# EAGLE schematic LayerOne_2016 (EAGLE 7.5.0)

## Sheet 1 of 3
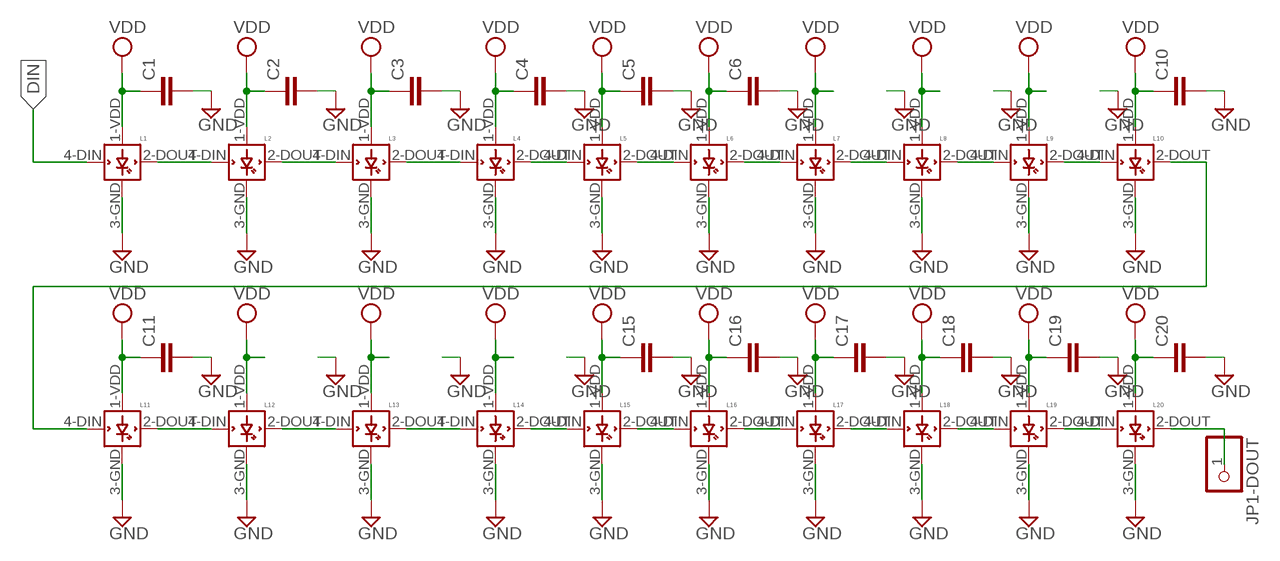
[diagram p0: schematic, sheet 1]

### Parts
C1  CAP0805  [0805]
C2  CAP0805  [0805]
C3  CAP0805  [0805]
C4  CAP0805  [0805]
C5  CAP0805  [0805]
C6  CAP0805  [0805]
C10  CAP0805  [0805]
C11  CAP0805  [0805]
C15  CAP0805  [0805]
C16  CAP0805  [0805]
C17  CAP0805  [0805]
C18  CAP0805  [0805]
C19  CAP0805  [0805]
C20  CAP0805  [0805]
JP1-DOUT  PINHD-1X1CB  [1X01-CLEANBIG]
L1  WS2812B  [WS2812B]
L2  WS2812B  [WS2812B]
L3  WS2812B  [WS2812B]
L4  WS2812B  [WS2812B]
L5  WS2812B  [WS2812B]
L6  WS2812B  [WS2812B]
L7  WS2812B  [WS2812B]
L8  WS2812B  [WS2812B]
L9  WS2812B  [WS2812B]
L10  WS2812B  [WS2812B]
L11  WS2812B  [WS2812B]
L12  WS2812B  [WS2812B]
L13  WS2812B  [WS2812B]
L14  WS2812B  [WS2812B]
L15  WS2812B  [WS2812B]
L16  WS2812B  [WS2812B]
L17  WS2812B  [WS2812B]
L18  WS2812B  [WS2812B]
L19  WS2812B  [WS2812B]
L20  WS2812B  [WS2812B]

### Nets
DIN: L1.4-DIN(DIN) ; also sheet 2
GND: C1.2 C2.2 C3.2 C4.2 C5.2 C6.2 C10.2 C11.2 C15.2 C16.2 C17.2 C18.2 C19.2 C20.2 L1.3-GND(GND) L2.3-GND(GND) L3.3-GND(GND) L4.3-GND(GND) L5.3-GND(GND) L6.3-GND(GND) L7.3-GND(GND) L8.3-GND(GND) L9.3-GND(GND) L10.3-GND(GND) L11.3-GND(GND) L12.3-GND(GND) L13.3-GND(GND) L14.3-GND(GND) L15.3-GND(GND) L16.3-GND(GND) L17.3-GND(GND) L18.3-GND(GND) L19.3-GND(GND) L20.3-GND(GND) ; also sheet 2,3
N$1: L1.2-DOUT(DOUT) L2.4-DIN(DIN)
N$2: L3.2-DOUT(DOUT) L4.4-DIN(DIN)
N$3: L4.2-DOUT(DOUT) L5.4-DIN(DIN)
N$4: L5.2-DOUT(DOUT) L6.4-DIN(DIN)
N$5: L6.2-DOUT(DOUT) L7.4-DIN(DIN)
N$6: L7.2-DOUT(DOUT) L8.4-DIN(DIN)
N$7: L8.2-DOUT(DOUT) L9.4-DIN(DIN)
N$8: L9.2-DOUT(DOUT) L10.4-DIN(DIN)
N$9: L11.2-DOUT(DOUT) L12.4-DIN(DIN)
N$10: L12.2-DOUT(DOUT) L13.4-DIN(DIN)
N$11: L13.2-DOUT(DOUT) L14.4-DIN(DIN)
N$12: L14.2-DOUT(DOUT) L15.4-DIN(DIN)
N$13: L15.2-DOUT(DOUT) L16.4-DIN(DIN)
N$14: L16.2-DOUT(DOUT) L17.4-DIN(DIN)
N$15: L17.2-DOUT(DOUT) L18.4-DIN(DIN)
N$16: L18.2-DOUT(DOUT) L19.4-DIN(DIN)
N$17: L19.2-DOUT(DOUT) L20.4-DIN(DIN)
N$25: L10.2-DOUT(DOUT) L11.4-DIN(DIN)
N$26: JP1-DOUT.1 L20.2-DOUT(DOUT)
N$27: L2.2-DOUT(DOUT) L3.4-DIN(DIN)
VCC: C1.1 C2.1 C3.1 C4.1 C5.1 C6.1 C10.1 C11.1 C15.1 C16.1 C17.1 C18.1 C19.1 C20.1 L1.1-VDD(VDD) L2.1-VDD(VDD) L3.1-VDD(VDD) L4.1-VDD(VDD) L5.1-VDD(VDD) L6.1-VDD(VDD) L7.1-VDD(VDD) L8.1-VDD(VDD) L9.1-VDD(VDD) L10.1-VDD(VDD) L11.1-VDD(VDD) L12.1-VDD(VDD) L13.1-VDD(VDD) L14.1-VDD(VDD) L15.1-VDD(VDD) L16.1-VDD(VDD) L17.1-VDD(VDD) L18.1-VDD(VDD) L19.1-VDD(VDD) L20.1-VDD(VDD) ; supply symbol labelled VDD ; also sheet 2,3

## Sheet 2 of 3
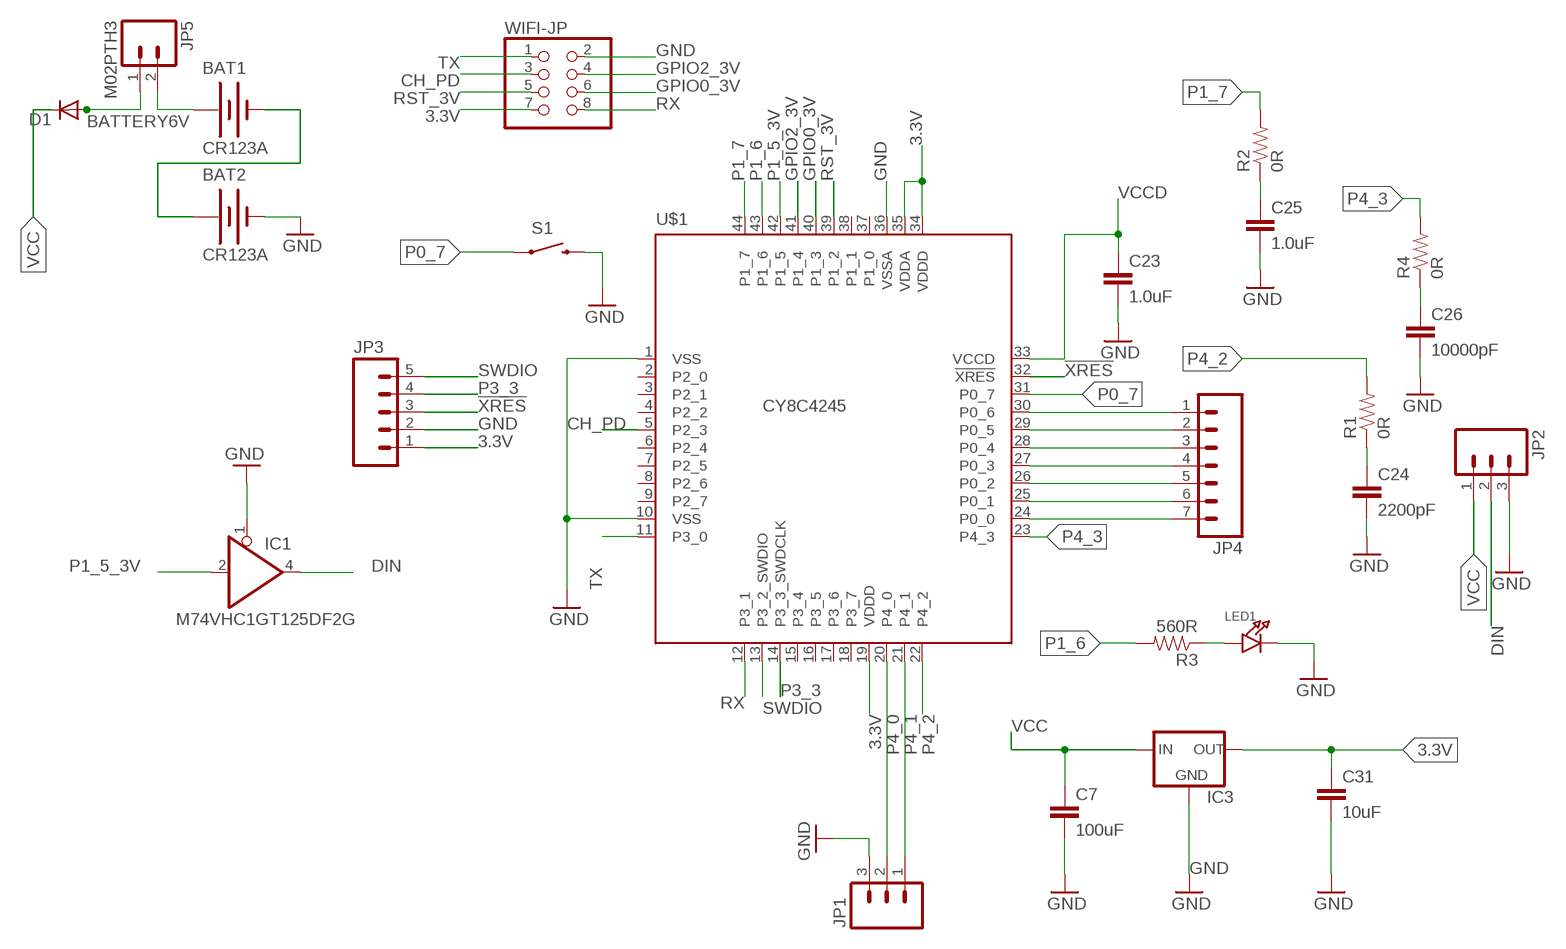
[diagram p1: schematic, sheet 2]

### Parts
BAT1  CR123A  TVBGONE-ADJ_BATTERYCR123A  [TVBGONE-ADJ_BATTERY_CR123A]
BAT2  CR123A  TVBGONE-ADJ_BATTERYCR123A  [TVBGONE-ADJ_BATTERY_CR123A]
C7  100uF  CAP0805  [0805]
C23  1.0uF  CAP0805  [0805]
C24  2200pF  CAP0805  [0805]
C25  1.0uF  CAP0805  [0805]
C26  10000pF  CAP0805  [0805]
C31  10uF  CAP0805  [0805]
D1  DIODESMA  [SMA-DIODE]
IC1  M74VHC1GT125DF2G  74AHCT1G125DBV  [SOT23-5]
IC3  LM1117  [SOT223]
JP1  M031X03_NO_SILK  [1X03_NO_SILK]
JP2  M031X03_NO_SILK  [1X03_NO_SILK]
JP3  M05PTH  [1X05]
JP4  M07  [1X07]
JP5  M02PTH3  [1X02_LONGPADS]
LED1  LED0805  [CHIPLED_0805]
R1  0R  RESISTOR0805-RES  [0805]
R2  0R  RESISTOR0805-RES  [0805]
R3  560R  RESISTOR0805-RES  [0805]
R4  0R  RESISTOR0805-RES  [0805]
S1  SPARKFUN_SWITCH-MOMENTARY-2SMD  [SPARKFUN_TACTILE_SWITCH_SMD]
U$1  CY8C4245  CY8C4245AXI-483  [TQFP44]
WIFI-JP  PINHD-2X4  [2X04]

### Nets
3.3V: C31.1 IC3.2(OUT) JP3.1 U$1.19(VDDD) U$1.34(VDDD) U$1.35(VDDA) WIFI-JP.7 ; also sheet 3
!XRES: JP3.3 U$1.32(!XRES)
BATTERY6V: D1.A JP5.1
CH_PD: U$1.5(P2_3) WIFI-JP.3
DIN: IC1.4(O) JP2.2 ; also sheet 1
GND: BAT2.- C7.2 C23.2 C24.2 C25.2 C26.2 C31.2 IC1.1(OE) IC3.1(GND) JP1.3 JP2.3 JP3.2 LED1.C S1.3 U$1.1(VSS) U$1.10(VSS) U$1.36(VSSA) WIFI-JP.2 ; also sheet 1,3
GPIO0_3V: U$1.40(P1_3) WIFI-JP.6
GPIO2_3V: U$1.41(P1_4) WIFI-JP.4
N$20: C24.1 R1.1
N$21: C25.1 R2.1
N$22: C26.1 R4.1
N$23: LED1.A R3.1
N$28: BAT1.- BAT2.+
N$29: JP4.7 U$1.24(P0_0)
N$30: JP4.6 U$1.25(P0_1)
N$31: JP4.5 U$1.26(P0_2)
N$32: JP4.4 U$1.27(P0_3)
N$33: JP4.3 U$1.28(P0_4)
N$34: JP4.2 U$1.29(P0_5)
N$35: JP4.1 U$1.30(P0_6)
N$36: BAT1.+ JP5.2
P0_7: S1.1 U$1.31(P0_7)
P1_5_3V: IC1.2(I) U$1.42(P1_5)
P1_6: R3.2 U$1.43(P1_6)
P1_7: R2.2 U$1.44(P1_7)
P3_3: JP3.4 U$1.14(P3_3_SWDCLK)
P4_0: JP1.2 U$1.20(P4_0)
P4_1: JP1.1 U$1.21(P4_1)
P4_2: R1.2 U$1.22(P4_2)
P4_3: R4.2 U$1.23(P4_3)
RST_3V: U$1.39(P1_2) WIFI-JP.5
RX: U$1.12(P3_1) WIFI-JP.8
SWDIO: JP3.5 U$1.13(P3_2_SWDIO)
TX: U$1.11(P3_0) WIFI-JP.1
VCC: C7.1 D1.C IC3.3(IN) JP2.1 ; also sheet 1,3
VCCD: C23.1 U$1.33(VCCD)
Unconnected: U$1.2(P2_0) U$1.3(P2_1) U$1.4(P2_2) U$1.6(P2_4) U$1.7(P2_5) U$1.8(P2_6) U$1.9(P2_7) U$1.15(P3_4) U$1.16(P3_5) U$1.17(P3_6) U$1.18(P3_7) U$1.37(P1_0) U$1.38(P1_1)

## Sheet 3 of 3
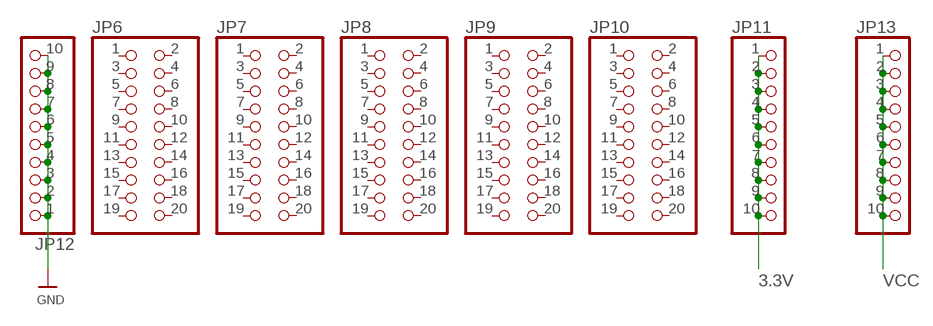
[diagram p2: schematic, sheet 3]

### Parts
JP6  PINHD-2X10  [2X10]
JP7  PINHD-2X10  [2X10]
JP8  PINHD-2X10  [2X10]
JP9  PINHD-2X10  [2X10]
JP10  PINHD-2X10  [2X10]
JP11  HEADER-1X10  [1X10_OVAL]
JP12  HEADER-1X10  [1X10_OVAL]
JP13  HEADER-1X10  [1X10_OVAL]

### Nets
3.3V: JP11.1 JP11.2 JP11.3 JP11.4 JP11.5 JP11.6 JP11.7 JP11.8 JP11.9 JP11.10 ; also sheet 2
GND: JP12.1 JP12.2 JP12.3 JP12.4 JP12.5 JP12.6 JP12.7 JP12.8 JP12.9 JP12.10 ; also sheet 1,2
VCC: JP13.1 JP13.2 JP13.3 JP13.4 JP13.5 JP13.6 JP13.7 JP13.8 JP13.9 JP13.10 ; also sheet 1,2
Unconnected: JP6.1 JP6.2 JP6.3 JP6.4 JP6.5 JP6.6 JP6.7 JP6.8 JP6.9 JP6.10 JP6.11 JP6.12 JP6.13 JP6.14 JP6.15 JP6.16 JP6.17 JP6.18 JP6.19 JP6.20 JP7.1 JP7.2 JP7.3 JP7.4 JP7.5 JP7.6 JP7.7 JP7.8 JP7.9 JP7.10 JP7.11 JP7.12 JP7.13 JP7.14 JP7.15 JP7.16 JP7.17 JP7.18 JP7.19 JP7.20 JP8.1 JP8.2 JP8.3 JP8.4 JP8.5 JP8.6 JP8.7 JP8.8 JP8.9 JP8.10 JP8.11 JP8.12 JP8.13 JP8.14 JP8.15 JP8.16 JP8.17 JP8.18 JP8.19 JP8.20 JP9.1 JP9.2 JP9.3 JP9.4 JP9.5 JP9.6 JP9.7 JP9.8 JP9.9 JP9.10 JP9.11 JP9.12 JP9.13 JP9.14 JP9.15 JP9.16 JP9.17 JP9.18 JP9.19 JP9.20 JP10.1 JP10.2 JP10.3 JP10.4 JP10.5 JP10.6 JP10.7 JP10.8 JP10.9 JP10.10 JP10.11 JP10.12 JP10.13 JP10.14 JP10.15 JP10.16 JP10.17 JP10.18 JP10.19 JP10.20

## Power pins joined to a net without a drawn wire
GND: IC1.3(GND)
VCC: IC1.5(VCC)

## Library data of the parts
BAT1 BAT2 = tvbgone-2layer:TVBGONE-ADJ_BATTERY: Battery Holders Various common sizes : AA, AAA, 20mm coin cell and 12mm coin cell.
C1-C6 C10 C11 C15-C20 = SparkFun-Passives:CAP: Capacitor Standard 0603 ceramic capacitor, and 0.1" leaded capacitor.
C7 C23-C26 C31 = SparkFun-Capacitors:CAP: Capacitor Standard 0603 ceramic capacitor, and 0.1" leaded capacitor.
D1 = SparkFun-DiscreteSemi:DIODE: Diode These are standard reverse protection diodes and small signal diodes. SMA package can handle up to about 1A. SOD-323 can handle about 200mA. What the SOD-323 package when ordering, there are some mfgs out there that are 5-pin packages.
IC1 = 74xx-little-de:74*1G125: Single Bus Buffer Gate with 3-State Output; DIGIKEY-ND: M74VHC1GT125DF1GOSCT-ND; MOUSER: 863-M74VHC1GT125DF2G; PARTNO: M74VHC1GT125DF2G
IC3 = v-reg-3:LM1117
JP1 JP2 = SparkFun-Connectors:M03: Header 3 Standard 3-pin 0.1" header. Use with straight break away headers (SKU : PRT-00116), right angle break away headers (PRT-00553), swiss pins (PRT-00743), machine pins (PRT-00117), and female headers (PRT-00115). Molex polarized connector foot print use with SKU : PRT-08232 with associated crimp pins and housings.
JP1-DOUT = adafruit:PINHD-1X1: Pin header 1x1 for 0.1" spacing With round pins
JP3 = SparkFun-Connectors:M05: Header 5 Standard 5-pin 0.1" header. Use with straight break away headers (SKU : PRT-00116), right angle break away headers (PRT-00553), swiss pins (PRT-00743), machine pins (PRT-00117), and female headers (PRT-00115). Molex polarized connector foot print use with SKU : PRT-08230 with associated crimp pins and housings.
JP4 = SparkFun:M07: Header 7 Standard 7-pin 0.1" header. Use with straight break away headers (SKU : PRT-00116), right angle break away headers (PRT-00553), swiss pins (PRT-00743), machine pins (PRT-00117), and female headers (PRT-00115). NOTES ON THE VARIANTS LOCK and LOCK_LONGPADS... This footprint was designed to help hold the alignment of a through-hole component (i.e. 7-pin header) while soldering it into place. You may notice that each hole has been shifted either up or down by 0.005 of an inch from it's more standard position (which is usually a perfectly straight line). This slight alteration caused the pins (the squares in the middle) to touch the edges of the holes. Because they are alternating, it causes a "brace" to hold the header in place. 0.005 has proven to be the perfect amount of "off-center" position when using our standard breakaway headers. Although looks a little odd when you look at the bare footprint, once you have a header in there, the alteration is very hard to notice. Also, if you push a header all the way into place, it is covered up entirely on the bottom side. This idea of altering the position of holes to aid alignment will be further integrated into the Sparkfun Library for other footprints. It can help hold any component with 3 or more connection pins.
JP5 = SparkFun-Connectors:M02: Standard 2-pin 0.1" header. Use with - straight break away headers ( PRT-00116) - right angle break away headers (PRT-00553) - swiss pins (PRT-00743) - machine pins (PRT-00117) - female headers (PRT-00115) Molex polarized connector foot print use with: PRT-08233 with associated crimp pins and housings. 2.54_SCREWTERM for use with PRT-10571. 3.5mm Screw Terminal footprints for PRT-08084 5mm Screw Terminal footprints for use with PRT-08433
JP6-JP10 = SparkFun-Connectors:PINHD-2X10: PIN HEADER
JP11-JP13 = microbuilder:HEADER-1X10: PIN HEADER
L1-L20 = adafruit:WS2812B
LED1 = microbuilder:LED: LED 0603 - 0603 Surface Mount Package Green LED - Low Power (3.9mcd, 2ma, 1.7Vf) Orange LED - Low Power (9.8mcd, 2ma, 1.8Vf) Red LED - Low Power (5mcd, 2ma, 1.8Vf) Yellow LED - Low Power (7mcd, 2ma, 1.8Vf) 0805 - 0805 Surface Mount Package 20mA: Red LED (104mcd, 20mA, Diffused) - LS R976 [Digikey: 475-1278-6-ND] Red LED (12mcd, 20mA, 2.0Vf, Clear) - APT2012EC [Digikey: 754-1128-1-ND] Green LED (15mcd, 20mA, 2.2Vf, Clear) - APT2012GC [Digikey: 754-1131-1-ND] Orange LED (160mcd, 20mA, 2.1Vf, Clear) - APT2012SECK [Digikey: 754-1130-1-ND] 2mA: Red LED (8.8mcd, 2mA, 1.8Vf, Clear) - Low Power [Digikey: 475-2510-1-ND] Green LED (5mcd, 2mA, 1.8Vf, Clear) - Low Power [Digikey: 475-2730-1-ND] Yellow LED (11.3mcd, 2mA, 1.8Vf, Clear) - Low Power [Digikey: 475-2555-1-ND] 1206 - 1206 Surface Mount Package Green LED (26mcd, 20mA, Diffused) - LG N971 [Digikey: 475-1407-6-ND] Red LED (15mcd, 20mA, Diffused) - LH N974 [Digikey: 475-1416-6-ND]
R1-R4 = SparkFun-Resistors:RESISTOR: Resistor Basic schematic elements and footprints for 0603, 1206, and PTH resistors.
S1 = Nullspace:SPARKFUN_SWITCH-MOMENTARY-2
U$1 = cypress:CY8C4245AXI-483
WIFI-JP = pinhead:PINHD-2X4: PIN HEADER

## Net classes
0 default: width 0.203 mm